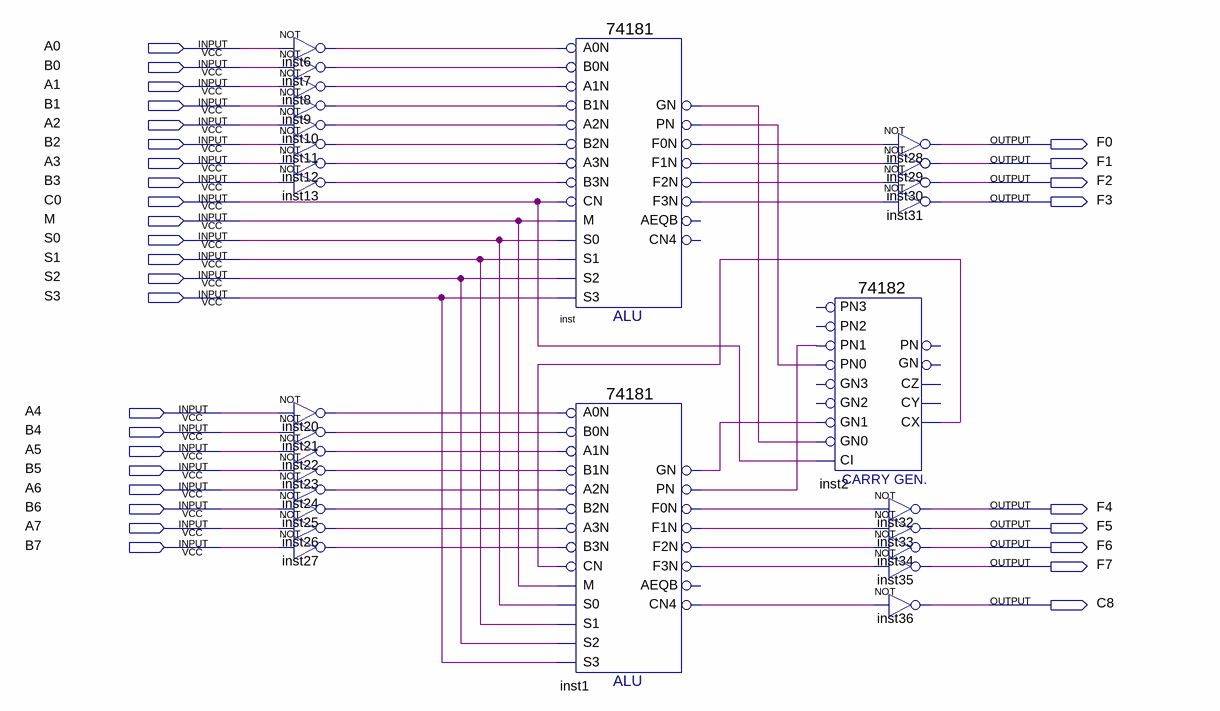
[diagram p0: schematic sheet]
// Quartus schematic ALU_parallel_8b.bdf as structural Verilog: 28 symbols, 31 pins
module ALU_parallel_8b (
  input  A0,
  input  B0,
  input  A1,
  input  B1,
  input  A2,
  input  B2,
  input  A3,
  input  B3,
  input  C0,
  input  M,
  input  S0,
  input  S1,
  input  S2,
  input  S3,
  input  A4,
  input  B4,
  input  A5,
  input  B5,
  input  A6,
  input  B6,
  input  A7,
  input  B7,
  output F0,
  output F1,
  output F2,
  output F3,
  output F4,
  output F5,
  output F6,
  output F7,
  output C8
);

  wire inst1_cn4, inst1_f0n, inst1_f1n, inst1_f2n, inst1_f3n, inst1_gn, inst1_pn, inst2_cx, inst6_out,
       inst7_out, inst8_out, inst9_out, inst10_out, inst11_out, inst12_out, inst13_out, inst20_out,
       inst21_out, inst22_out, inst23_out, inst24_out, inst25_out, inst26_out, inst27_out, inst_f0n,
       inst_f1n, inst_f2n, inst_f3n, inst_gn, inst_pn;

  not inst6 (inst6_out, A0);
  not inst7 (inst7_out, B0);
  not inst8 (inst8_out, A1);
  not inst9 (inst9_out, B1);
  not inst10 (inst10_out, A2);
  not inst11 (inst11_out, B2);
  not inst12 (inst12_out, A3);
  not inst13 (inst13_out, B3);
  not inst20 (inst20_out, A4);
  not inst21 (inst21_out, B4);
  not inst22 (inst22_out, A5);
  not inst23 (inst23_out, B5);
  not inst24 (inst24_out, A6);
  not inst25 (inst25_out, B6);
  not inst26 (inst26_out, A7);
  not inst27 (inst27_out, B7);
  \74181  inst (
    .B0N(inst7_out), .A0N(inst6_out), .A1N(inst8_out), .B1N(inst9_out), .A3N(inst12_out), .B2N(inst11_out),
    .A2N(inst10_out), .M(M), .CN(C0), .B3N(inst13_out), .S2(S2), .S1(S1), .S0(S0), .S3(S3), .PN(inst_pn),
    .GN(inst_gn), .F3N(inst_f3n), .F1N(inst_f1n), .F0N(inst_f0n), .F2N(inst_f2n));  // open: AEQB, CN4
  \74181  inst1 (
    .B0N(inst21_out), .A0N(inst20_out), .A1N(inst22_out), .B1N(inst23_out), .A3N(inst26_out),
    .B2N(inst25_out), .A2N(inst24_out), .M(M), .CN(inst2_cx), .B3N(inst27_out), .S2(S2), .S1(S1), .S0(S0),
    .S3(S3), .PN(inst1_pn), .GN(inst1_gn), .F3N(inst1_f3n), .F1N(inst1_f1n), .F0N(inst1_f0n),
    .CN4(inst1_cn4), .F2N(inst1_f2n));  // open: AEQB
  \74182  inst2 (
    .CI(C0), .PN1(inst1_pn), .PN0(inst_pn), .GN1(inst1_gn), .GN0(inst_gn), .CX(inst2_cx));  // open: PN2, GN2, GN3, PN3, CY, PN, CZ, GN
  not inst28 (F0, inst_f0n);
  not inst29 (F1, inst_f1n);
  not inst30 (F2, inst_f2n);
  not inst31 (F3, inst_f3n);
  not inst32 (F4, inst1_f0n);
  not inst33 (F5, inst1_f1n);
  not inst34 (F6, inst1_f2n);
  not inst35 (F7, inst1_f3n);
  not inst36 (C8, inst1_cn4);
endmodule
